# EAGLE design Walking_analysis_design (EAGLE 9.6.2)
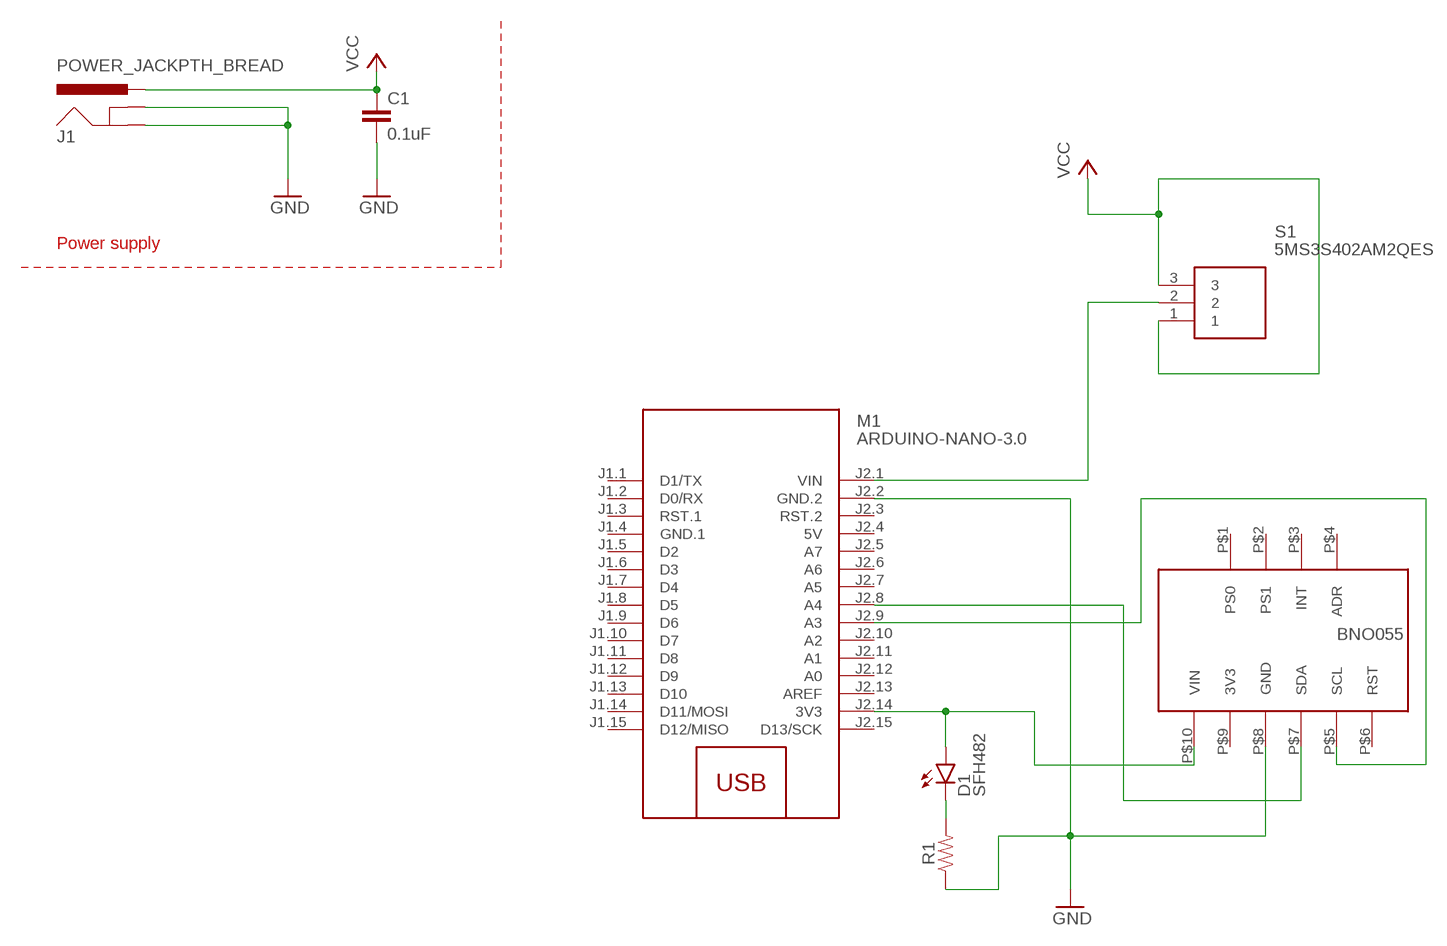
[diagram p0: schematic, sheet 1]

## Parts
C1  0.1uF  0.1UF-KIT-EZ-50V-20%  [CAP-PTH-SMALL-KIT]
D1  SFH482  [SFH482]
J1  POWER_JACKPTH_BREAD  [POWER_JACK_PTH_BREAD]
M1  ARDUINO-NANO-3.0  [ARDUINO-NANO-3.0]
R1  RESISTORAXIAL-0.3  [AXIAL-0.3]
S1  5MS3S402AM2QES  [5MS3S402AM2QES]
U$1  BNO055  [BNO055_FOOTPRINT]

## Nets
GND: C1.2 J1.GND J1.GNDBREAK M1.J2.2(GND.2) R1.P$1 U$1.P$8(GND)
N$1: M1.J2.8(A4) U$1.P$7(SDA)
N$2: M1.J2.9(A3) U$1.P$5(SCL)
N$3: D1.A M1.J2.14(3V3) U$1.P$10(VIN)
N$4: M1.J2.1(VIN) S1.2
N$5: D1.K(C) R1.P$2
VCC: C1.1 J1.PWR S1.1 S1.3
Unconnected: M1.J1.1(D1/TX) M1.J1.2(D0/RX) M1.J1.3(RST.1) M1.J1.5(D2) M1.J1.6(D3) M1.J1.7(D4) M1.J1.8(D5) M1.J1.9(D6) M1.J1.10(D7) M1.J1.11(D8) M1.J1.12(D9) M1.J1.13(D10) M1.J1.14(D11/MOSI) M1.J1.15(D12/MISO) M1.J2.3(RST.2) M1.J2.5(A7) M1.J2.6(A6) M1.J2.7(A5) M1.J2.10(A2) M1.J2.11(A1) M1.J2.12(A0) M1.J2.13(AREF) M1.J2.15(D13/SCK) U$1.P$1(PS0) U$1.P$2(PS1) U$1.P$3(INT) U$1.P$4(ADR) U$1.P$6(RST)

## Notes on the sheet
- Power supply

## Power pins joined to a net without a drawn wire
3V3: U$1.P$9(3V3)
5V: M1.J2.4(5V)
GND.1: M1.J1.4(GND.1)

## Library data of the parts
C1 = SparkFun-Capacitors:0.1UF: 0.1µF ceramic capacitors A capacitor is a passive two-terminal electrical component used to store electrical energy temporarily in an electric field.; PROD_ID: CAP-08370
D1 = led:SFH482: IR LED infrared emitting diode, Infineon
J1 = SparkFun-Connectors:POWER_JACK: Power Jack Connector This is the standard 5.5mm barrel jack for power. The PTH is the most common, proven, reliable, footprint. The Slot footprint only works if the mill layer is transmitted to the PCB fab house so be warned. Here are the connectors we sell at SparkFun: DC Barrel Power Jack/Connector <https://www.sparkfun.com/products/119> (PRT-00119) DC Barrel Power Jack/Connector (SMD) <https://www.sparkfun.com/products/12748> (PRT-12748) DC Barrel Jack Adapter - Breadboard Compatible <https://www.sparkfun.com/products/10811> (PRT-10811) It is used on this SparkFun product (and many, many others): SparkFun RedBoard - Programmed with Arduino <https://www.sparkfun.com/products/12757> (DEV-12757) Also, if you need a mating power supply or connector, please check these out: Wall Adapter Power Supply - 9VDC 650mA <https://www.sparkfun.com/products/298> (TOL-00298) DC Barrel Jack Adapter - Male <https://www.sparkfun.com/products/10287> (PRT-10287); PROD_ID: COMP-13253
M1 = diy-modules:ARDUINO-NANO-3.0: Arduino Nano 3.0 and compatible devices More details available here: https://www.arduino.cc/en/Main/ArduinoBoardNano Click here to find device on ebay.com <http://www.ebay.com/sch/arduino+nano>
R1 = SparkFun-Resistors:RESISTOR: Generic Resistor Package
S1 = SamacSys_Parts:5MS3S402AM2QES: PCB Slide Switch SPDT On-Off-On 5 A@ 28 V dc Top Source: Datasheet; DESCRIPTION: PCB Slide Switch SPDT On-Off-On 5 A@ 28 V dc Top; HEIGHT: 9.91mm; MANUFACTURER_NAME: RS Components; MANUFACTURER_PART_NUMBER: 5MS3S402AM2QES; RS_PART_NUMBER: 7347334; RS_PRICE-STOCK: https://uk.rs-online.com/web/p/products/7347334
U$1 = Arduino:BNO055: BNO055_walking analysis

## Board
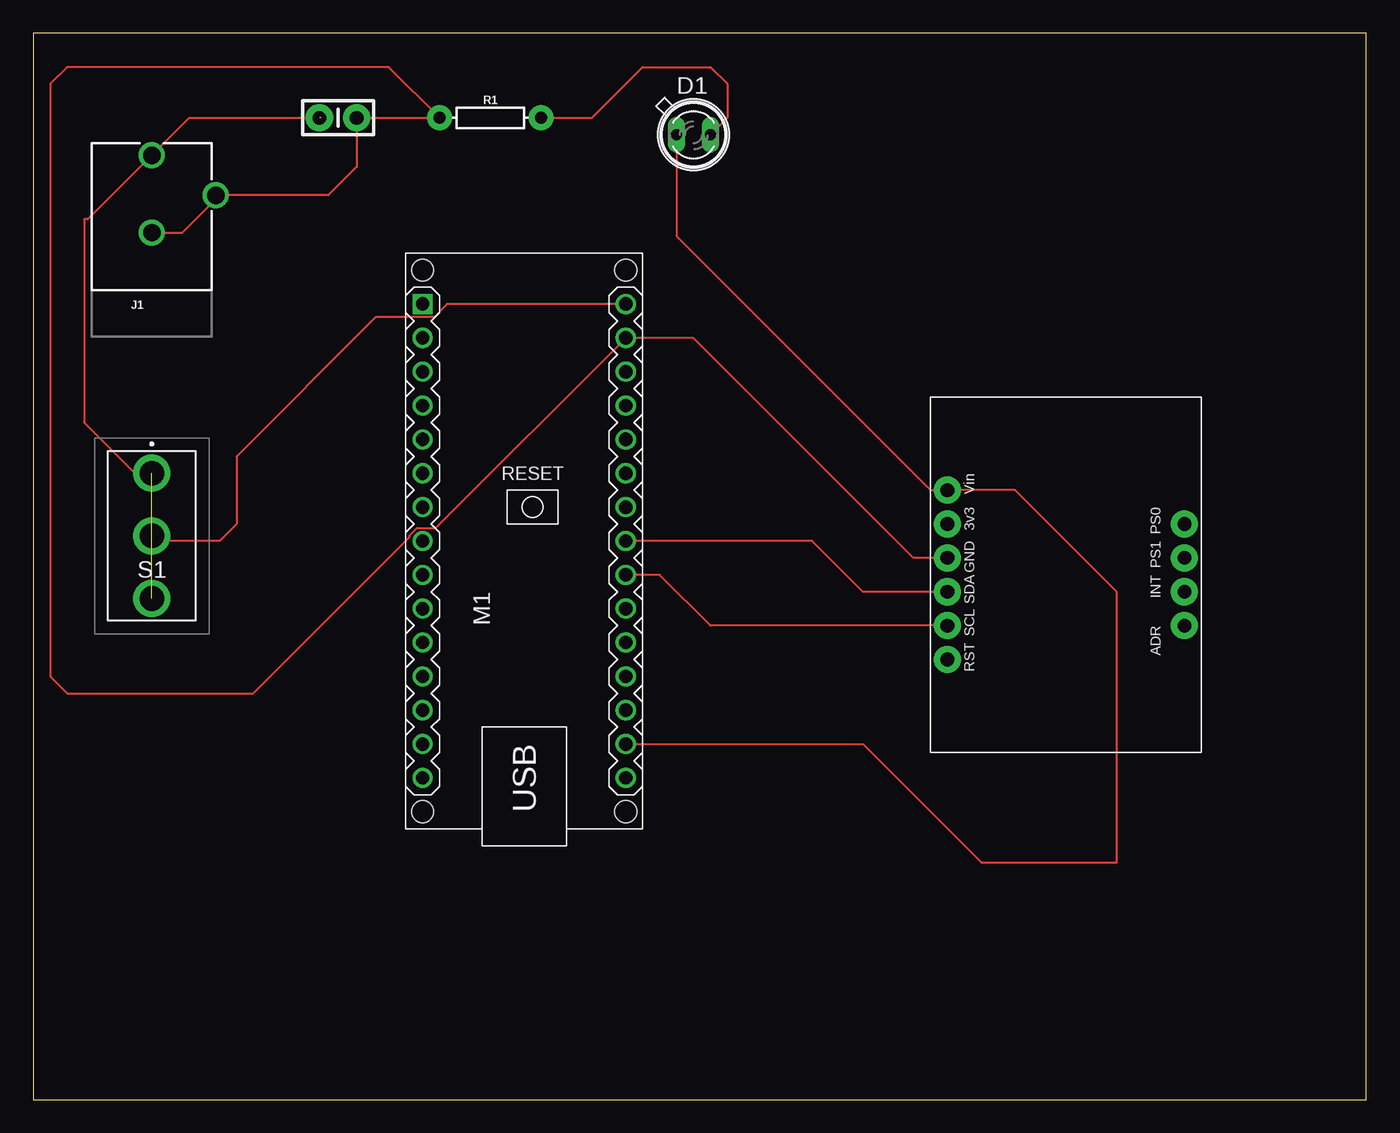
[diagram p1: board, top side]

Size 100 x 80 mm. Coordinates in mm from the lower left corner, seen from the top.
Outline: 0,0 100,0 100,80 0,80 0,0
Copper layers (1*16): Top 0.035mm / dielectric 1.5mm / Bottom 0.035mm
Design rules "default": minimum track width 6mil, minimum drill 0.35mm, track to track 6mil, track to pad 6mil, pad to pad 6mil, via to via 6mil, smd to smd 6mil, copper to edge 40mil, drill to drill 6mil, minimum pad ring 10mil, minimum via ring 8mil, stop-mask expansion 4mil, vias tented up to drill 0mil, thermal gap 10mil

### Footprints (pad centres in the part's own frame; a part is rotated, then mirrored left to right if it is on the bottom)
CAP-PTH-SMALL-KIT = drill 1.016 pad 2.032: 1 -1.397,0; 2 1.397,0
SFH482 = drill 0.813 long: A -1.27,0; K 1.27,0
POWER_JACK_PTH_BREAD = drill 1.3: GND 0,7.9; GNDBREAK 4.8,10.7; PWR 0,13.7
ARDUINO-NANO-3.0 = drill 1 square: J1.1 17.78,7.62 | drill 1: J1.2 15.24,7.62; J1.3 12.7,7.62; J1.4 10.16,7.62; J1.5 7.62,7.62; J1.6 5.08,7.62; J1.7 2.54,7.62; J1.8 0,7.62; J1.9 -2.54,7.62; J1.10 -5.08,7.62; J1.11 -7.62,7.62; J1.12 -10.16,7.62; J1.13 -12.7,7.62; J1.14 -15.24,7.62; J1.15 -17.78,7.62; J2.1 17.78,-7.62; J2.2 15.24,-7.62; J2.3 12.7,-7.62; J2.4 10.16,-7.62; J2.5 7.62,-7.62; J2.6 5.08,-7.62; J2.7 2.54,-7.62; J2.8 0,-7.62; J2.9 -2.54,-7.62; J2.10 -5.08,-7.62; J2.11 -7.62,-7.62; J2.12 -10.16,-7.62; J2.13 -12.7,-7.62; J2.14 -15.24,-7.62; J2.15 -17.78,-7.62 | hole 1.651: -20.32,7.62; -20.32,-7.62; 20.32,-7.62; 20.32,7.62
AXIAL-0.3 = drill 0.9 pad 1.88: P$1 -3.81,0; P$2 3.81,0
5MS3S402AM2QES = drill 1.85 pad 2.775: 1 0,0; 2 0,4.7; 3 0,9.4
BNO055_FOOTPRINT = drill 1.016 pad 2.032: P$1 -3.81,19.05; P$2 -1.27,19.05; P$3 1.27,19.05; P$4 3.81,19.05; P$5 3.81,1.27; P$6 6.35,1.27; P$7 1.27,1.27; P$8 -1.27,1.27; P$9 -3.81,1.27; P$10 -6.35,1.27

### Placement (x,y rotation side)
C1  22.86,73.66 0 top
D1  49.53,72.39 0 top
J1  8.89,57.15 0 top
M1  36.83,41.91 90 top
R1  34.29,73.66 0 top
S1  8.89,46.99 180 top
U$1  67.31,39.37 270 top

### Tracks (layer width: path | path; a pad name or v marks a point on that pad's centre or on a via)
GND
  Top 0.152: 13.97,67.85 22.13,67.85 24.26,69.98 C1.2 R1.P$1 26.67,77.47 2.54,77.47 1.27,76.2 1.27,31.75 2.54,30.48 16.51,30.48 28.23,42.2 28.23,42.32 28.8,42.89 30.19,42.89 M1.J2.2 49.53,57.15 66.04,40.64 U$1.P$8 | 13.97,67.85 J1.GNDBREAK | J1.GND 11.17,65.05 13.97,67.85
N$1
  Top 0.152: U$1.P$7 62.23,38.1 58.42,41.91 M1.J2.8
N$2
  Top 0.152: M1.J2.9 46.99,39.37 50.8,35.56 U$1.P$5
N$3
  Top 0.152: D1.A 48.26,64.77 67.31,45.72 U$1.P$10 73.66,45.72 81.28,38.1 81.28,17.78 71.12,17.78 62.23,26.67 M1.J2.14
N$4  (1 unrouted)
  Top 0.152: M1.J2.1 31.04,59.69 30.06,58.71 25.69,58.71 15.24,48.26 15.24,43.18 13.97,41.91 8.89,41.91
N$5
  Top 0.152: R1.P$2 41.91,73.66 45.72,77.47 50.8,77.47 52.07,76.2 52.07,73.66 D1.K
VCC  (2 unrouted)
  Top 0.152: S1.1 7.62,46.99 3.81,50.8 3.81,66.04 4.08,66.04 J1.PWR 11.7,73.66 21.59,73.66